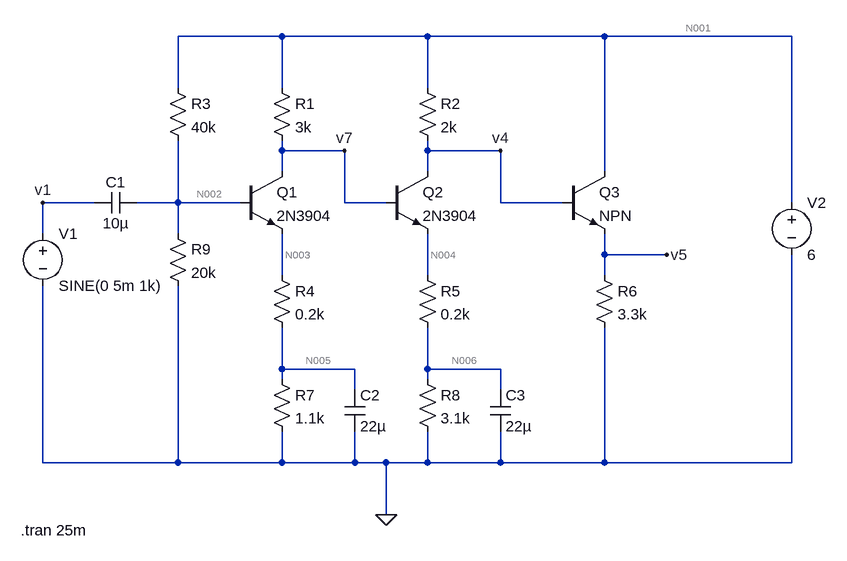
[diagram p0: schematic amp.asc]
amp.asc, the LTspice schematic file:
Version 4
SHEET 1 968 680
WIRE 128 -96 -32 -96
WIRE 352 -96 128 -96
WIRE 624 -96 352 -96
WIRE 912 -96 624 -96
WIRE -32 -16 -32 -96
WIRE 128 -16 128 -96
WIRE 352 -16 352 -96
WIRE 128 80 128 64
WIRE 224 80 128 80
WIRE 352 80 352 64
WIRE 464 80 352 80
WIRE 128 112 128 80
WIRE 352 112 352 80
WIRE 624 112 624 -96
WIRE -160 160 -240 160
WIRE -32 160 -32 64
WIRE -32 160 -96 160
WIRE 64 160 -32 160
WIRE 224 160 224 80
WIRE 288 160 224 160
WIRE 464 160 464 80
WIRE 560 160 464 160
WIRE 912 160 912 -96
WIRE -240 208 -240 160
WIRE -32 208 -32 160
WIRE 624 240 624 208
WIRE 720 240 624 240
WIRE 128 272 128 208
WIRE 352 272 352 208
WIRE 624 272 624 240
WIRE 128 416 128 352
WIRE 240 416 128 416
WIRE 352 416 352 352
WIRE 464 416 352 416
WIRE 128 432 128 416
WIRE 352 432 352 416
WIRE 240 448 240 416
WIRE 464 448 464 416
WIRE -240 560 -240 288
WIRE -32 560 -32 288
WIRE -32 560 -240 560
WIRE 128 560 128 512
WIRE 128 560 -32 560
WIRE 240 560 240 512
WIRE 240 560 128 560
WIRE 288 560 240 560
WIRE 352 560 352 512
WIRE 352 560 288 560
WIRE 464 560 464 512
WIRE 464 560 352 560
WIRE 624 560 624 352
WIRE 624 560 464 560
WIRE 912 560 912 240
WIRE 912 560 624 560
WIRE 288 640 288 560
FLAG 288 640 0
FLAG 720 240 v5
FLAG 464 80 v4
FLAG 224 80 v7
FLAG -240 160 v1
SYMBOL npn 64 112 R0
SYMATTR InstName Q1
SYMATTR Value 2N3904
SYMBOL npn 288 112 R0
SYMATTR InstName Q2
SYMATTR Value 2N3904
SYMBOL npn 560 112 R0
SYMATTR InstName Q3
SYMBOL res 112 -32 R0
SYMATTR InstName R1
SYMATTR Value 3k
SYMBOL res 336 -32 R0
SYMATTR InstName R2
SYMATTR Value 2k
SYMBOL res -48 -32 R0
SYMATTR InstName R3
SYMATTR Value 40k
SYMBOL res 112 256 R0
SYMATTR InstName R4
SYMATTR Value 0.2k
SYMBOL res 336 256 R0
SYMATTR InstName R5
SYMATTR Value 0.2k
SYMBOL res 608 256 R0
SYMATTR InstName R6
SYMATTR Value 3.3k
SYMBOL res 112 416 R0
SYMATTR InstName R7
SYMATTR Value 1.1k
SYMBOL res 336 416 R0
SYMATTR InstName R8
SYMATTR Value 3.1k
SYMBOL res -48 192 R0
SYMATTR InstName R9
SYMATTR Value 20k
SYMBOL cap -96 144 R90
WINDOW 0 0 32 VBottom 2
WINDOW 3 32 32 VTop 2
SYMATTR InstName C1
SYMATTR Value 10µ
SYMBOL voltage -240 192 R0
WINDOW 123 0 0 Left 0
WINDOW 39 0 0 Left 0
SYMATTR InstName V1
SYMATTR Value SINE(0 5m 1k)
SYMBOL voltage 912 144 R0
WINDOW 123 0 0 Left 0
WINDOW 39 0 0 Left 0
SYMATTR InstName V2
SYMATTR Value 6
SYMBOL cap 224 448 R0
SYMATTR InstName C2
SYMATTR Value 22µ
SYMBOL cap 448 448 R0
SYMATTR InstName C3
SYMATTR Value 22µ
TEXT -274 664 Left 2 !.tran 25m

The netlist it stands for:
* amp.asc
Q1 v7 N002 N003 0 2N3904
Q2 v4 v7 N004 0 2N3904
Q3 N001 v4 v5 0 NPN
R1 N001 v7 3k
R2 N001 v4 2k
R3 N001 N002 40k
R4 N003 N005 0.2k
R5 N004 N006 0.2k
R6 v5 0 3.3k
R7 N005 0 1.1k
R8 N006 0 3.1k
R9 N002 0 20k
C1 N002 v1 10µ
V1 v1 0 SINE(0 5m 1k)
V2 N001 0 6
C2 N005 0 22µ
C3 N006 0 22µ
.model NPN NPN
.model PNP PNP
.lib standard.bjt
.tran 25m
.backanno
.end

* Results of the author's LTspice run, read from the files saved beside the schematic
* Operating Point, zero values left out:
*   V(v7) = 3.001 V
*   V(n002) = 1.956 V
*   V(n003) = 1.301 V
*   V(v4) = 4.555 V
*   V(n004) = 2.354 V
*   V(n001) = 6 V
*   V(v5) = 3.778 V
*   V(n005) = 1.101 V
*   V(n006) = 2.212 V
*   Ic(Q1) = 997.5 µA
*   Ib(Q1) = 3.299 µA
*   Ie(Q1) = -1.001 mA
*   Ic(Q2) = 711.1 µA
*   Ib(Q2) = 2.338 µA
*   Ie(Q2) = -713.5 µA
*   Ic(Q3) = 1.133 mA
*   Ib(Q3) = 11.33 µA
*   Ie(Q3) = -1.145 mA
*   I(R1) = 999.8 µA
*   I(R2) = 722.5 µA
*   I(R3) = 101.1 µA
*   I(R4) = 1.001 mA
*   I(R5) = 713.5 µA
*   I(R6) = 1.145 mA
*   I(R7) = 1.001 mA
*   I(R8) = 713.5 µA
*   I(R9) = 97.8 µA
*   I(V2) = -2.957 mA
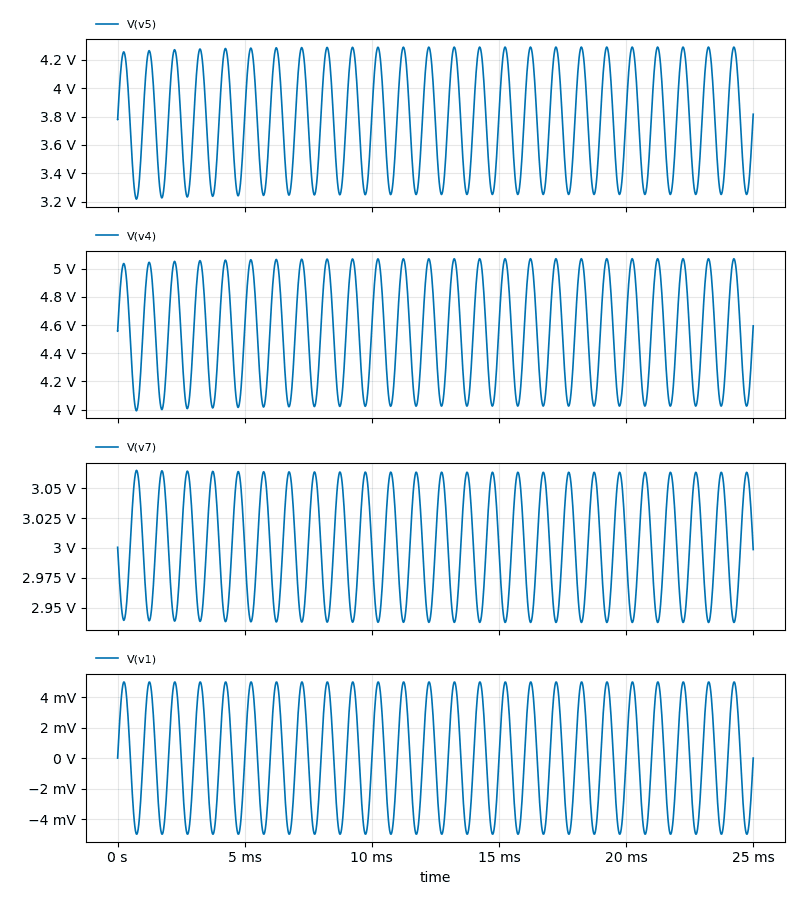
[diagram p1: Transient Analysis of amp.asc, plotted from the saved traces]
* Transient Analysis, 1 run:
*   V(v5): min 3.218 V, max 4.289 V, average 3.772 V, rms 3.79 V, last 3.816 V
*   V(v4): min 3.992 V, max 5.07 V, average 4.55 V, rms 4.565 V, last 4.594 V
*   V(v7): min 2.938 V, max 3.065 V, average 3.001 V, rms 3.001 V, last 2.999 V
*   V(v1): min -4.991 mV, max 4.996 mV, average 1.066 nV, rms 3.536 mV, last 0 V